# Altium schematic sheet Micromouse_Khoemach.SchDoc
size A4; SheetNumber: 1; SheetTotal: 6
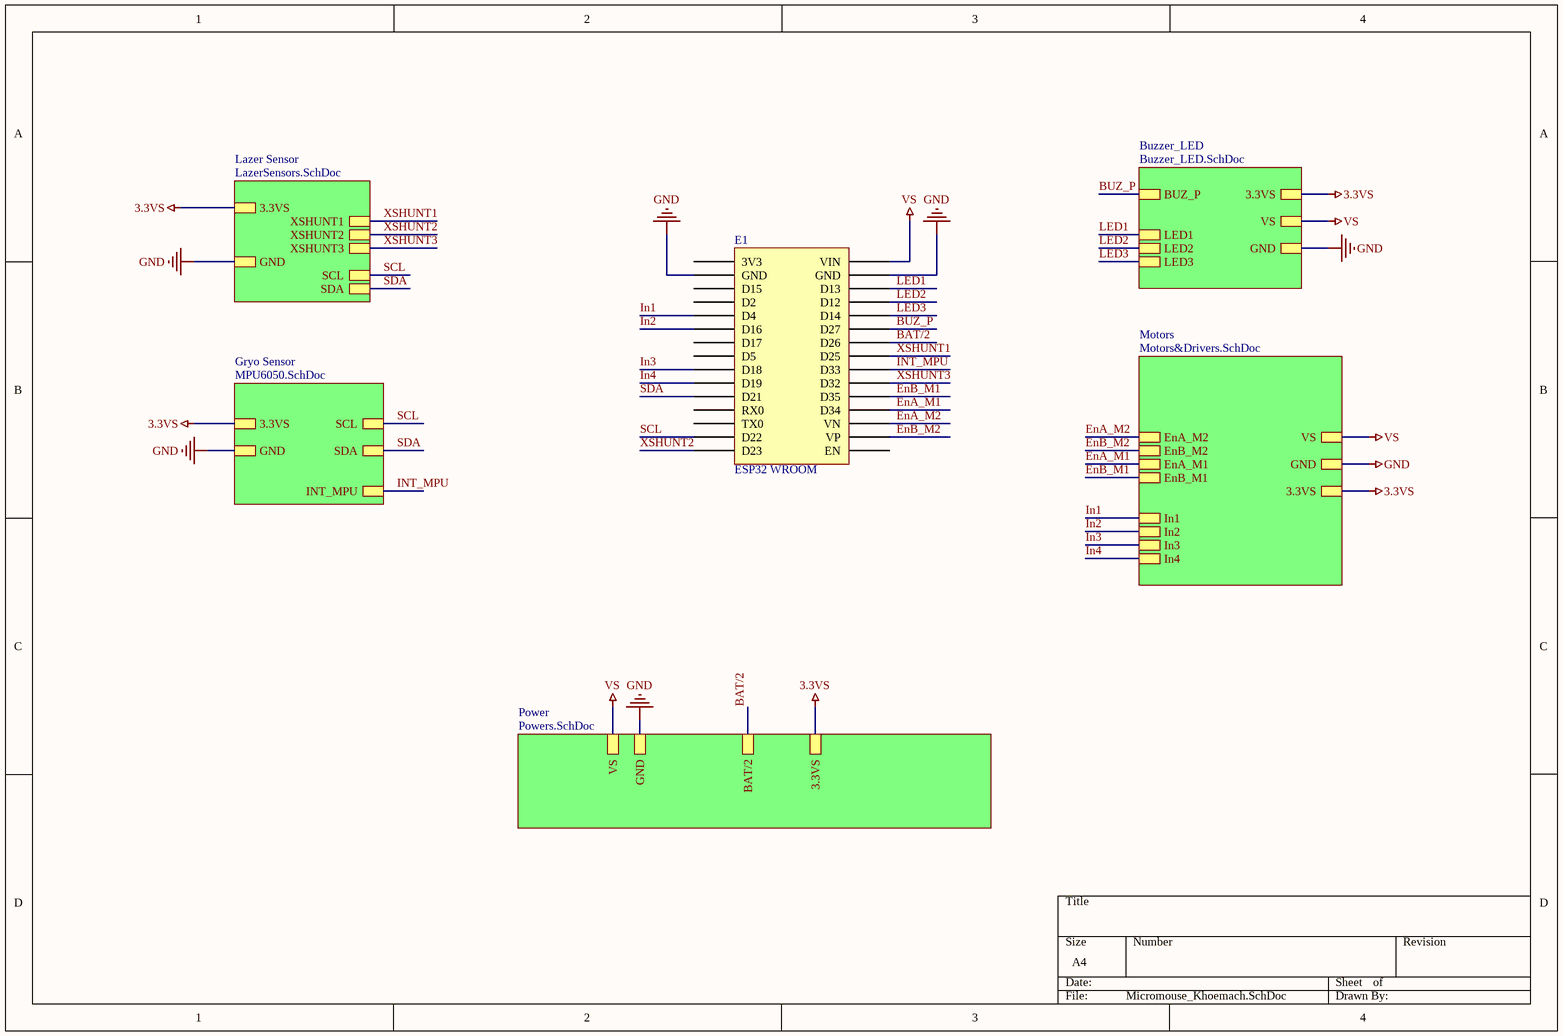
[diagram p0: Micromouse_Khoemach.SchDoc]

## Parts
E1  ESP32 WROOM  [ESP32 WROOM]

## Sub-sheets
Buzzer_LED = Buzzer_LED.SchDoc: BUZ_P, LED1, LED2, LED3, 3.3VS, GND, VS
Gryo Sensor = MPU6050.SchDoc: SDA, SCL, GND, 3.3VS, INT_MPU
Lazer Sensor = LazerSensors.SchDoc: SDA, SCL, GND, 3.3VS, XSHUNT1, XSHUNT2, XSHUNT3
Motors = Motors&Drivers.SchDoc: In1, In2, In3, In4, EnA_M1, EnA_M2, EnB_M1, EnB_M2, VS, GND, 3.3VS
Power = Powers.SchDoc: VS, GND, BAT/2, 3.3VS

## Nets
3.3VS: sheet Lazer Sensor/3.3VS, sheet Gryo Sensor/3.3VS, sheet Power/3.3VS, sheet Motors/3.3VS, sheet Buzzer_LED/3.3VS
GND: E1.GND ; sheet Lazer Sensor/GND, sheet Gryo Sensor/GND, sheet Power/GND, sheet Motors/GND, sheet Buzzer_LED/GND
VS: E1.VIN ; sheet Power/VS, sheet Motors/VS, sheet Buzzer_LED/VS
BAT/2: E1.D26 ; sheet Power/BAT/2
BUZ_P: E1.D27 ; sheet Buzzer_LED/BUZ_P
EnA_M1: E1.D34 ; sheet Motors/EnA_M1
EnA_M2: E1.VN ; sheet Motors/EnA_M2
EnB_M1: E1.D35 ; sheet Motors/EnB_M1
EnB_M2: E1.VP ; sheet Motors/EnB_M2
In1: E1.D4 ; sheet Motors/In1
In2: E1.D16 ; sheet Motors/In2
In3: E1.D18 ; sheet Motors/In3
In4: E1.D19 ; sheet Motors/In4
INT_MPU: E1.D33 ; sheet Gryo Sensor/INT_MPU
LED1: E1.D13 ; sheet Buzzer_LED/LED1
LED2: E1.D12 ; sheet Buzzer_LED/LED2
LED3: E1.D14 ; sheet Buzzer_LED/LED3
SCL: E1.D22 ; sheet Lazer Sensor/SCL, sheet Gryo Sensor/SCL
SDA: E1.D21 ; sheet Lazer Sensor/SDA, sheet Gryo Sensor/SDA
XSHUNT1: E1.D25 ; sheet Lazer Sensor/XSHUNT1
XSHUNT2: E1.D23 ; sheet Lazer Sensor/XSHUNT2
XSHUNT3: E1.D32 ; sheet Lazer Sensor/XSHUNT3

Not connected (* = marked no-connect by the designer): E1 3V3 D2 D5 D15 D17 EN RX0 TX0